# Altium schematic sheet 12V.SchDoc
size A3; SheetNumber: 23; SheetTotal: 29; SPICEModelCacheJKCRVRTA: <root> / <DocumentId>JKCRVRTA</DocumentId> / </root>
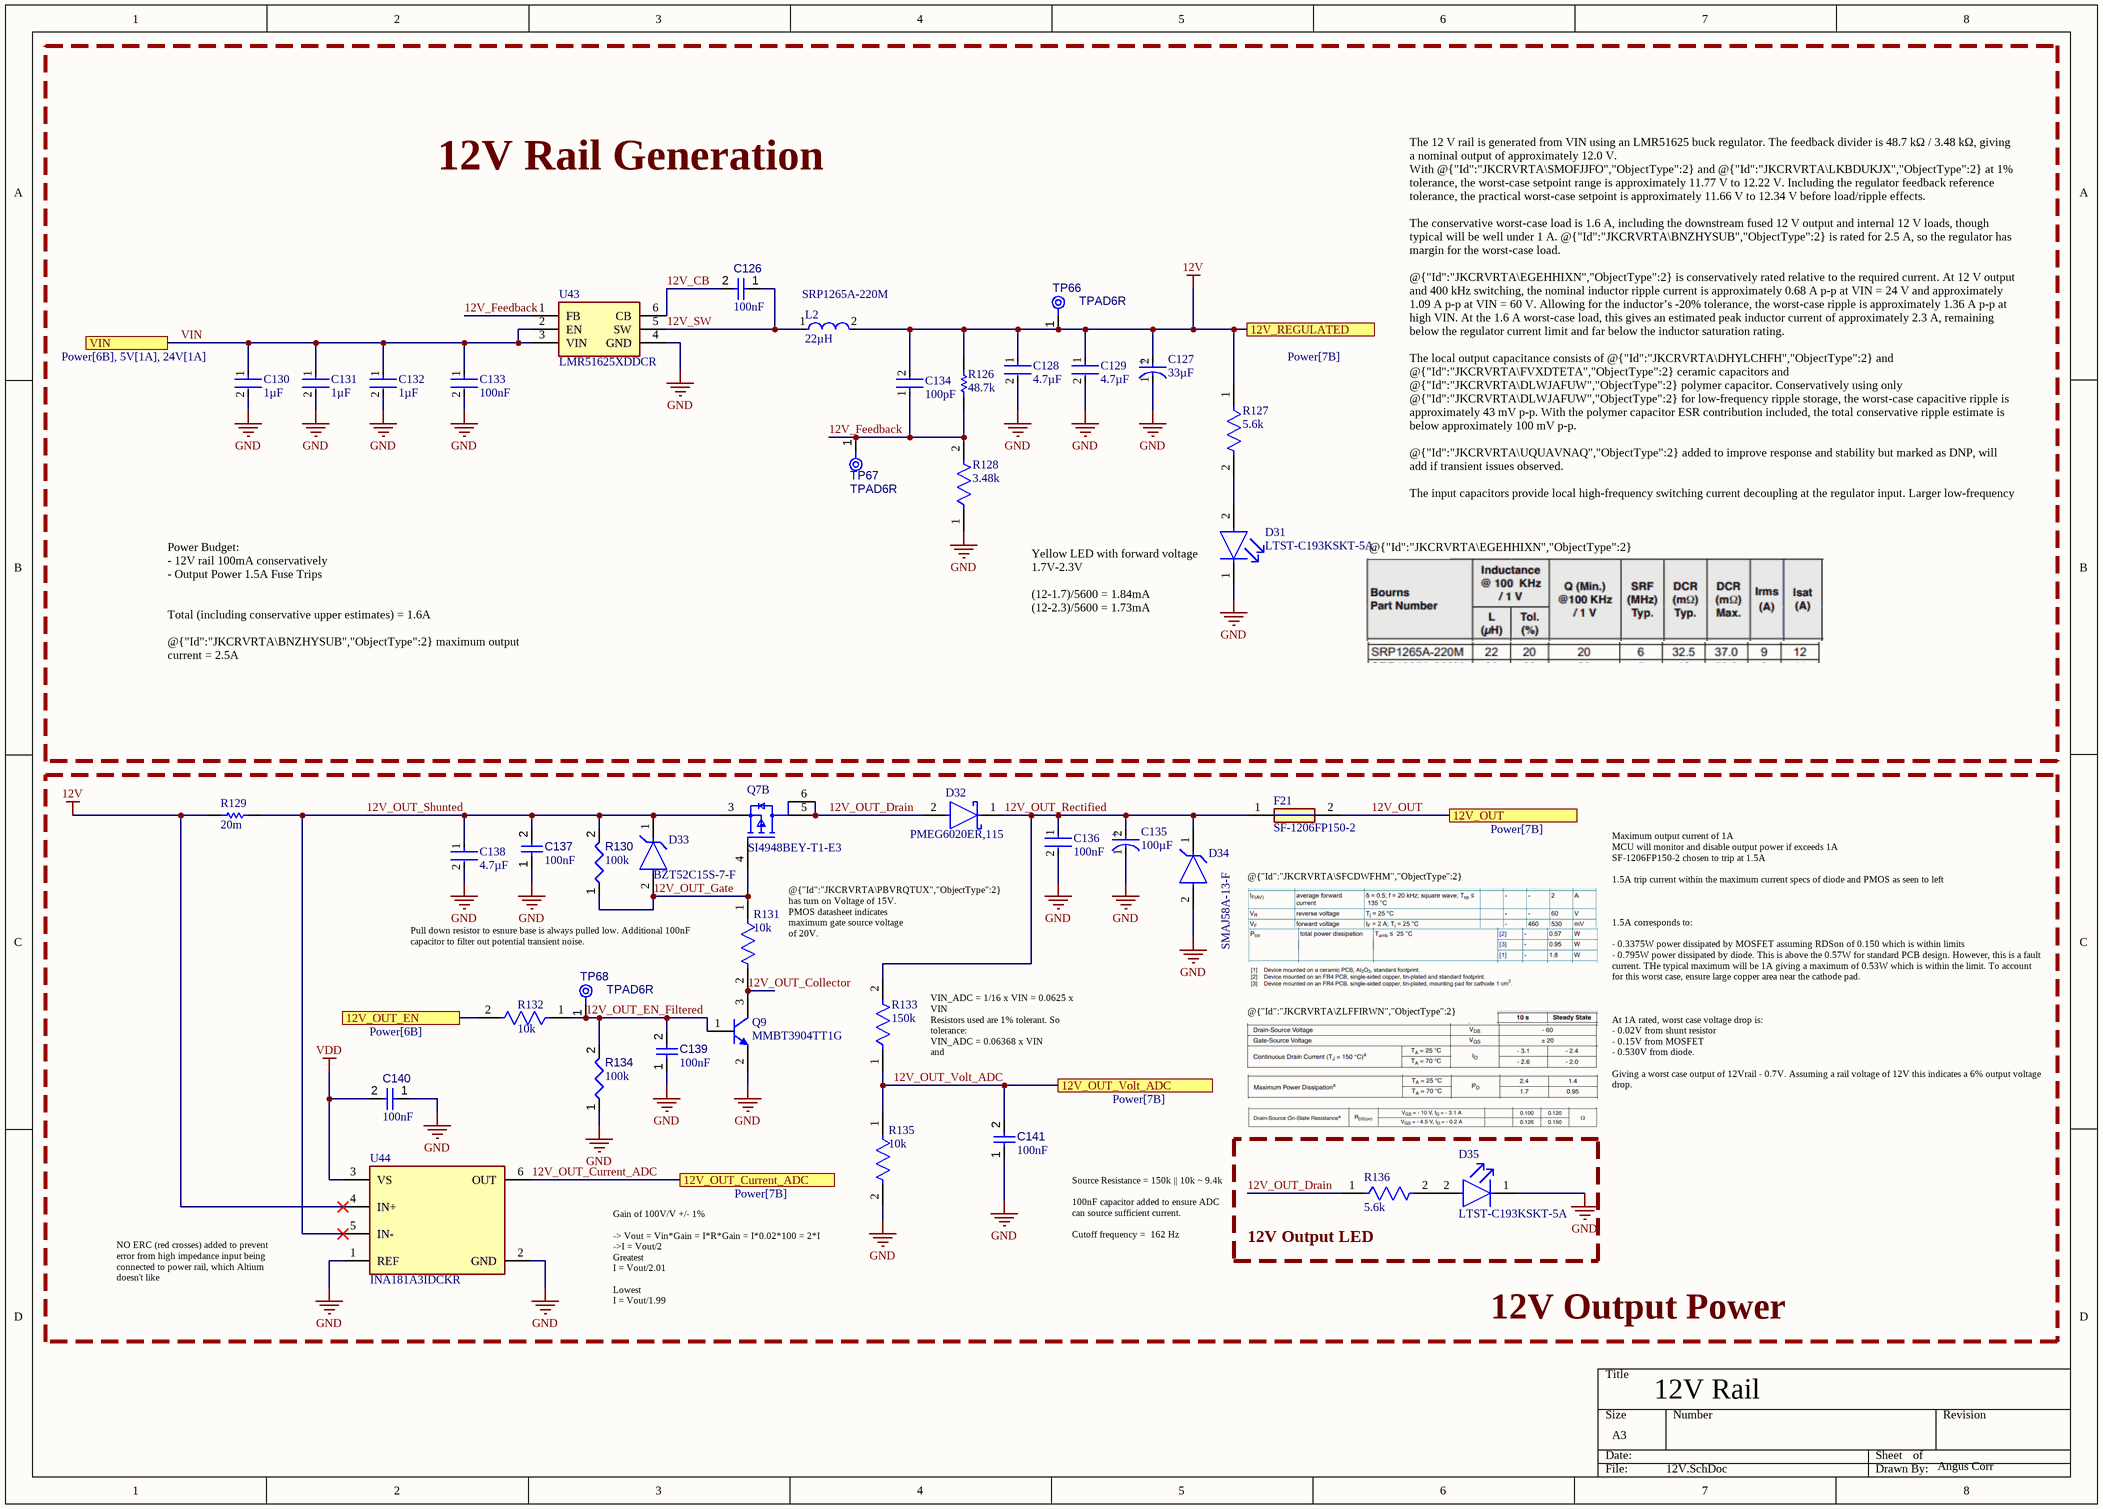
[diagram p0: 12V.SchDoc]

## Parts
C126  value 100nF  [CAPC1608X90X40NL10T20]  (hidden comment: Capacitor 100 nF +/-10% 50 V 0603)
C127  value 33µF  [FP-EEH-D8-MFG]  (hidden comment: EEHZA1H330XP)
C128  value 4.7µF  [FP-GRM21B-0_2-e0_2_0_7-MFG]  (hidden comment: GRM21BZ71H475KE15L)
C129  value 4.7µF  [FP-GRM21B-0_2-e0_2_0_7-MFG]  (hidden comment: GRM21BZ71H475KE15L)
C130  value 1µF  [FP-GRJ21B-0_35-MFG]  (hidden comment: GRJ21BC72A105KE11L)
C131  value 1µF  [FP-GRJ21B-0_35-MFG]  (hidden comment: GRJ21BC72A105KE11L)
C132  value 1µF  [FP-GRJ21B-0_35-MFG]  (hidden comment: GRJ21BC72A105KE11L)
C133  value 100nF  [FP-GRM31C-0_2-e0_3_0_8-IPC_C]  (hidden comment: GRM31C5C2A104JA01L)
C134  value 100pF  [FP-C0603C-CF-IPC_B]  (hidden comment: C0603C101F5HACTU)
C135  value 100µF  [FP-MVYAKE0-MFG]  (hidden comment: EMVY101ARA101MKE0S)
C136  value 100nF  [FP-GRM31C-0_2-e0_3_0_8-IPC_C]  (hidden comment: GRM31C5C2A104JA01L)
C137  value 100nF  [CAPC1608X90X40NL10T20]  (hidden comment: Capacitor 100 nF +/-10% 50 V 0603)
C138  value 4.7µF  [FP-GRM21B-0_2-e0_2_0_7-MFG]  (hidden comment: GRM21BZ71H475KE15L)
C139  value 100nF  [CAPC1608X90X40NL10T20]  (hidden comment: Capacitor 100 nF +/-10% 50 V 0603)
C140  value 100nF  [CAPC1608X90X40NL10T20]  (hidden comment: Capacitor 100 nF +/-10% 50 V 0603)
C141  value 100nF  [CAPC1608X90X40NL10T20]  (hidden comment: Capacitor 100 nF +/-10% 50 V 0603)
D31  LTST-C193KSKT-5A  [FP-LTST-C193KGKT-5A-MFG]
D32  PMEG6020ER,115  [FP-SOD123W-MFG]
D33  BZT52C15S-7-F  [FP-SOD323-IPC_A]
D34  SMAJ58A-13-F  [FP-SMA-MFG]
D35  LTST-C193KSKT-5A  [FP-LTST-C193KGKT-5A-MFG]
F21  SF-1206FP150-2  [FUSC3116X70N]
L2  value 22µH  [FP-SRP1265A-MFG]  (hidden comment: SRP1265A-220M)
Q7  SI4948BEY-T1-E3  [FP-C-06527-IPC_B]  (part B of 2)
Q9  MMBT3904TT1G  [ONSC-SC-75-3-463-01_V]
R126  value 48.7k  [RESC1608X55X25ML10T15]  (hidden comment: RC0603FR-0748K7L)
R127  value 5.6k  [FP-RT0603-IPC_C]  (hidden comment: RT0603FRE075K6L)
R128  value 3.48k  [FP-AC0603-IPC_C]  (hidden comment: AC0603FR-073K48L)
R129  value 20m  [RESC3216X89X51NL25T25]  (hidden comment: WSL1206R0200FEA)
R130  value 100k  [FP-AC0603-IPC_C]  (hidden comment: AC0603FR-07100KL)
R131  value 10k  [FP-RT0603-IPC_C]  (hidden comment: RT0603BRD0710KL)
R132  value 10k  [FP-RT0603-IPC_C]  (hidden comment: RT0603BRD0710KL)
R133  value 150k  [FP-CRGCQ0603-IPC_A]  (hidden comment: CRGCQ0603F150K)
R134  value 100k  [FP-AC0603-IPC_C]  (hidden comment: AC0603FR-07100KL)
R135  value 10k  [FP-RT0603-IPC_C]  (hidden comment: RT0603BRD0710KL)
R136  value 5.6k  [FP-RT0603-IPC_C]  (hidden comment: RT0603FRE075K6L)
TP66  TPAD6R  [TP06R]  (no BOM)
TP67  TPAD6R  [TP06R]  (no BOM)
TP68  TPAD6R  [TP06R]  (no BOM)
U43  LMR51625XDDCR  [SOT95P280X110-6N]
U44  INA181A3IDCKR  [FP-DCK0006A-IPC_A]

## Blocks framed on the sheet
12V Rail Generation: C126-C134 D31 L2 R126-R128 TP66 TP67 U43
12V Output Power: C135-C141 D32-D34 F21 Q7 Q9 R129-R135 TP68 U44
12V Output LED: D35 R136

## Ports
12V_OUT (see Power[7B]), 12V_OUT_Current_ADC (see Power[7B]), 12V_OUT_EN (see Power[6B]), 12V_OUT_Volt_ADC (see Power[7B]), 12V_REGULATED (see Power[7B]), VIN (see Power[6B], 5V[1A], 24V[1A])

## Nets
12V: C127.2(A) C128.1 C129.1 C134.2 L2.2 R126.2 R127.1 R129.1 TP66.1(TP) U44.4(IN+) ; port 12V_REGULATED
GND: C127.1(C) C128.2 C129.2 C130.2 C131.2 C132.2 C133.2 C135.1(C) C136.2 C137.1 C138.2 C139.1 C140.1 C141.1 D31.1(C) D34.2(A) D35.1(C) Q9.2(E) R128.1 R134.1 R135.2 U43.4(GND) U44.1(REF) U44.2(GND)
VDD: C140.2 U44.3(VS)
12V_CB: C126.2 U43.6(CB)
12V_Feedback: C134.1 R126.1 R128.2 TP67.1(TP) U43.1(FB)
12V_OUT: F21.2 ; port 12V_OUT
12V_OUT_Collector: Q9.3(C) R131.2
12V_OUT_Current_ADC: U44.6(OUT) ; port 12V_OUT_Current_ADC
12V_OUT_Drain: D32.2(A) Q7.5(D2) Q7.6(D2) R136.1
12V_OUT_EN: R132.2 ; port 12V_OUT_EN
12V_OUT_EN_Filtered: C139.2 Q9.1(B) R132.1 R134.2 TP68.1(TP)
12V_OUT_Gate: D33.2(A) Q7.4(G2) R130.1 R131.1
12V_OUT_Rectified: C135.2(A) C136.1 D32.1(C) D34.1(C) F21.1 R133.2
12V_OUT_Shunted: C137.2 C138.1 D33.1(C) Q7.3(S2) R129.2 R130.2 U44.5(IN-)
12V_OUT_Volt_ADC: C141.2 R133.1 R135.1 ; port 12V_OUT_Volt_ADC
12V_SW: C126.1 L2.1 U43.5(SW)
VIN: C130.1 C131.1 C132.1 C133.1 U43.2(EN) U43.3(VIN) ; port VIN
NetD31_2: D31.2(A) R127.2
NetD35_2: D35.2(A) R136.2

## Notes on the sheet
- (near L2) SRP1265A-220M
- The 12 V rail is generated from VIN using an LMR51625 buck regulator. The feedback divider is 48.7 kΩ / 3.48 kΩ, giving a nominal output of approximately 12.0 V.
  With @{"Id":"JKCRVRTA\SMOFJJFO","ObjectType":2} and @{"Id":"JKCRVRTA\LKBDUKJX","ObjectType":2} at 1% tolerance, the worst-case setpoint range is approximately 11.77 V to 12.22 V. Including the regulator feedback reference tolerance, the practical worst-case setpoint is approximately 11.66 V to 12.34 V before load/ripple effects.
  The conservative worst-case load is 1.6 A, including the downstream fused 12 V output and internal 12 V loads, though typical will be well under 1 A. @{"Id":"JKCRVRTA\BNZHYSUB","ObjectType":2} is rated for 2.5 A, so the regulator has margin for the worst-case load.
  @{"Id":"JKCRVRTA\EGEHHIXN","ObjectType":2} is conservatively rated relative to the required current. At 12 V output and 400 kHz switching, the nominal inductor ripple current is approximately 0.68 A p-p at VIN = 24 V and approximately 1.09 A p-p at VIN = 60 V. Allowing for the inductor’s -20% tolerance, the worst-case ripple is approximately 1.36 A p-p at high VIN. At the 1.6 A worst-case load, this gives an estimated peak inductor current of approximately 2.3 A, remaining below the regulator current limit and far below the inductor saturation rating.
  The local output capacitance consists of @{"Id":"JKCRVRTA\DHYLCHFH","ObjectType":2} and @{"Id":"JKCRVRTA\FVXDTETA","ObjectType":2} ceramic capacitors and @{"Id":"JKCRVRTA\DLWJAFUW","ObjectType":2} polymer capacitor. Conservatively using only @{"Id":"JKCRVRTA\DLWJAFUW","ObjectType":2} for low-frequency ripple storage, the worst-case capacitive ripple is approximately 43 mV p-p. With the polymer capacitor ESR contribution included, the total conservative ripple estimate is below approximately 100 mV p-p.
  @{"Id":"JKCRVRTA\UQUAVNAQ","ObjectType":2} added to improve response and stability but marked as DNP, will add if transient issues observed.
  The input capacitors provide local high-frequency switching current decoupling at the regulator input. Larger low-frequency energy storage is provided by the upstream 100 µF bulk capacitance.
  VIN should remain comfortably above 12 V under load. In normal operation from the 24 V/VIN rail there is substantial duty-cycle margin, unlike the 24 V regulator which operates closer to dropout.
- @{"Id":"JKCRVRTA\EGEHHIXN","ObjectType":2} stats
- (near D31) Yellow LED with forward voltage 1.7V-2.3V
  (12-1.7)/5600 = 1.84mA
  (12-2.3)/5600 = 1.73mA
- Power Budget:
  - 12V rail 100mA conservatively
  - Output Power 1.5A Fuse Trips
  Total (including conservative upper estimates) = 1.6A
  @{"Id":"JKCRVRTA\BNZHYSUB","ObjectType":2} maximum output current = 2.5A
- @{"Id":"JKCRVRTA\SFCDWFHM","ObjectType":2} specs
- Pull down resistor to esnure base is always pulled low. Additional 100nF capacitor to filter out potential transient noise.
- @{"Id":"JKCRVRTA\PBVRQTUX","ObjectType":2} has turn on Voltage of 15V. PMOS datasheet indicates maximum gate source voltage of 20V.
- VIN_ADC = 1/16 x VIN = 0.0625 x VIN
  Resistors used are 1% tolerant. So tolerance:
  VIN_ADC = 0.06368 x VIN
  and
  VIN_ADC = 0.06238 x VIN
- @{"Id":"JKCRVRTA\ZLFFIRWN","ObjectType":2} specs
- Source Resistance = 150k || 10k ~ 9.4k
  100nF capacitor added to ensure ADC can source sufficient current.
  Cutoff frequency =  162 Hz
- Maximum output current of 1A
  MCU will monitor and disable output power if exceeds 1A
  SF-1206FP150-2 chosen to trip at 1.5A
  1.5A trip current within the maximum current specs of diode and PMOS as seen to left
  1.5A corresponds to:
  - 0.3375W power dissipated by MOSFET assuming RDSon of 0.150 which is within limits
  - 0.795W power dissipated by diode. This is above the 0.57W for standard PCB design. However, this is a fault current. THe typical maximum will be 1A giving a maximum of 0.53W which is within the limit. To account for this worst case, ensure large copper area near the cathode pad.
  At 1A rated, worst case voltage drop is:
  - 0.02V from shunt resistor
  - 0.15V from MOSFET
  - 0.530V from diode.
  Giving a worst case output of 12Vrail - 0.7V. Assuming a rail voltage of 12V this indicates a 6% output voltage drop.
- NO ERC (red crosses) added to prevent error from high impedance input being connected to power rail, which Altium doesn't like
- (near R135) Gain of 100V/V +/- 1%
  -> Vout = Vin*Gain = I*R*Gain = I*0.02*100 = 2*I
  ->I = Vout/2
  Greatest
  I = Vout/2.01
  Lowest
  I = Vout/1.99
- 12V Rail
- Angus Corr
- (in symbol CMP-001-00104-1) +
- (in symbol CMP-001-00147-1) +

## Library data of the parts
C126 C137 C139-C141 = CMP-001-00017-6: Chip Capacitor, 100 nF, +/- 10%, 50 V, 0603 (1608 Metric); Voltage Rating: 50V; Capacitor Type: Ceramic; Tolerance: 10%; Mounting Technology: SM; Max Operating Temperature: 125°C; RoHS Compliant: True; Pins: 2; Case/Package: 0603; Min Operating Temperature: -55°C
C127 = CMP-001-00147-1: Cap Aluminum 33uF 50V 20% (6.3 X 7.7mm) SMD 0.04 Ohm 1600mA 5000 hr 105°C Embossed T/R; Ripple Current (AC): 1.6A; Max Operating Temperature: 105°C; Voltage Rating: 50V; Mounting Technology: Surface Mount; Pins: 8; Ripple Current: 1.6A; Tolerance: 20%; Min Operating Temperature: -55°C; Case/Package: Radial
C128 C129 C138 = CMP-001-00149-1: 50V 4.7uF X7R ±10% 0805 Multilayer Ceramic Capacitors MLCC - SMD/SMT ROHS; Manufacturer Lifecycle Status: IN PRODUCTION; Case/Package: 0805; Tolerance: 10%; Voltage Rating: 50V; Min Operating Temperature: -55°C; Mounting Technology: Surface Mount; Max Operating Temperature: 125°C; Country of Origin: Japan, Mainland China, Philippines, Singapore, Thailand; Dielectric Material: Ceramic; Export Control Classification Number (ECCN) Code: EAR99; Harmonized Tariff Schedule (HTS) Code: 8532.24.00.20; Height: 1.25mm; Introduction Date: 2017-02-22; Length: 2mm; Lifecycle Status: Production; Material: Ceramic; Number of Terminals: 2; REACH SVHC: Yes; RoHS: Compliant; Thickness: 1.25mm; Voltage Rating (DC): 50V; Width: 1.25mm
C130-C132 = CMP-001-00143-2: 100V 1uF X7S ±10% 0805 Multilayer Ceramic Capacitors MLCC - SMD/SMT ROHS; Manufacturer Lifecycle Status: IN PRODUCTION; Mounting Technology: Surface Mount; Voltage Rating: 100V; Max Operating Temperature: 125°C; Min Operating Temperature: -55°C; Tolerance: 10%; Case/Package: 0805; Case Code (Imperial): 0805; Case Code (Metric): 2012; Dielectric Material: Ceramic; Dielectric: X7S; Export Control Classification Number (ECCN) Code: EAR99; Features: Soft Termination; Harmonized Tariff Schedule (HTS) Code: 8532.24.00.20; Height: 1.25mm; Introduction Date: 2015-11-10; Length: 2mm; Lifecycle Status: Production; Material: Ceramic; Number of Terminals: 2; Packaging: Cut Tape; REACH SVHC: Yes; RoHS: Compliant; Schedule B: 8532240020, 8532240020; Thickness: 1.25mm; Voltage Rating (DC): 100V; Width: 1.25mm
C133 C136 = CMP-001-00103-1: 100V 100nF C0G ±5% 1206 Multilayer Ceramic Capacitors MLCC - SMD/SMT ROHS; Min Operating Temperature: -55°C; Mounting Technology: Surface Mount; Case/Package: 1206; Max Operating Temperature: 125°C; Tolerance: 5%; Voltage Rating: 100V
C134 = CMP-001-00115-1: Multilayer Ceramic Capacitors MLCC - SMD/SMT 50V 100pF X8R 0603 1%; Temperature Coefficient: 30ppm/°C; Lead Free: Lead Free; Width: 800µm; Schedule B: 8532240020, 8532240020; Introduction Date: 2017-10-02; Harmonized Tariff Schedule (HTS) Code: 8532.24.00.20; Voltage Rating (DC): 50V; Lifecycle Status: Production; Number of Terminals: 2; Height: 800µm; REACH SVHC: Yes; Dielectric Material: Ceramic; Country of Origin: Mexico; Voltage Rating: 50V; Mounting Technology: Surface Mount; Length: 1.6mm; China RoHS: Compliant; RoHS: Compliant; Case/Package: 0603; Max Operating Temperature: 150°C; Export Control Classification Number (ECCN) Code: EAR99; Dielectric: X8R; Material: Ceramic; Min Operating Temperature: -55°C
C135 = CMP-001-00104-1: Cap Aluminum 100uF 100V 20% (12.5 X 13.5mm) SMD 450mA 5000h 105°C T/R; Mounting Technology: Surface Mount; Ripple Current: 450mA; Tolerance: 20%; Case/Package: SMD/SMT; Pins: 2; Max Operating Temperature: 105°C; Min Operating Temperature: -40°C; Voltage Rating: 100V; Ripple Current (AC): 450mA
D31 D35 = CMP-007-00044-1: LED yellow 0603 wavelength 587~594.5nm light intensity 7.1~45mcd Front Mounting; Shape: Rectangular; Power Dissipation: 50mW; Peak Wavelength: 591nm; Number of Circuits: 1; Lens Style: Colorless, Diffused, Rectangular; Test Current: 5mA; Forward Voltage: 2.3V; Lens Transparency: Clear; Lens Color: Clear, Colorless; Viewing Angle: 130°; Forward Current: 30mA; Reverse Voltage: 5V; Luminous Intensity: 26.05mcd; Schedule B: 8541402000, 8541402000; Introduction Date: 2007-04-09; Min Operating Temperature: -55°C; RoHS: Compliant; Terminal Pitch: 1.5mm; Case/Package: 0603; Width: 800µm; Dominant Wavelength: 594.5nm; Pins: 2; Case Code (Imperial): 0603; Height: 350µm; Length: 1.6mm; Color: Yellow; Lead Free: Lead Free; Max Operating Temperature: 85°C; Wavelength: 594.5nm; Harmonized Tariff Schedule (HTS) Code: 8541.40.20.00; China RoHS: Compliant; Illumination Color: Yellow; Number of Terminals: 2; Radiation Hardening: No; Case Code (Metric): 1608; Number of LEDs: 1; Depth: 800µm; Lifecycle Status: Production; REACH SVHC: Yes; Mounting Technology: Surface Mount; Number of Elements: 1
D32 = CMP-004-00064-1: PMEG6020 Series 60 V 2 A SMT Llow VF MEGA Schottky Barrier Rectifier - SOD-123W; Forward Current: 2A; Forward Voltage: 530mV; Min Operating Temperature: -55°C; Max Operating Temperature: 150°C; Pins: 2
D33 = CMP-004-00045-1: BZT52C15S Series 200 mW 15 V 10 mA Surface Mount Zener Diode - SOD-323; Forward Voltage: 900mV; Forward Current: 10mA; Pins: 2; Max Operating Temperature: 150°C; Mounting Technology: Surface Mount; Min Operating Temperature: -65°C
D34 = CMP-004-00082-1: SMAJ Series 58 V 400 W SMT Uni-Directional TVS Diode - DO-214AC; Forward Voltage: 3.5V; Max Surge Current: 40A; Case/Package: SMA; Max Operating Temperature: 150°C; Min Operating Temperature: -55°C; Mounting Technology: Surface Mount; Pins: 2
F21 = CMP-005-00025-1: Surface Mount Fuses 1.5A Fast Acting 1206 Singlfuse; Manufacturer_Name: Bourns; Mouser Part Number: 652-SF-1206FP150-2; Mouser Price/Stock: https://www.mouser.co.uk/ProductDetail/Bourns/SF-1206FP150-2?qs=YCa%2FAAYMW02QT85STQYHfQ%3D%3D; Manufacturer_Part_Number: SF-1206FP150-2; Datasheet Link: https://www.arrow.com/en/products/sf-1206fp150-2/bourns; Source: MAX17643ATC+.SchLib; Arrow Part Number: SF-1206FP150-2; Design Item ID: SF-1206FP150-2; Height: 0.7mm; Arrow Price/Stock: https://www.arrow.com/en/products/sf-1206fp150-2/bourns?utm_currency=USD&region=nac
L2 = CMP-006-00026-1: Inductor Power Shielded Wirewound 22uH 20% 100KHz 20Q-Factor Carbonyl Powder 9A 0.037Ohm DCR Automotive T/R; Self Resonant Frequency: 6MHz; Min Operating Temperature: -55°C; Tolerance: 20%; Max Current Rating: 9A; Case/Package: Nonstandard; Max Operating Temperature: 150°C; Mounting Technology: Surface Mount; Current Rating: 9A
Q7 = CMP-013-00038-1: Dual P-Channel 60 V 0.12 Ohms Surface Mount Power Mosfet - SOIC-8; Nominal Vgs: -3V; Max Operating Temperature: 175°C; Mounting Technology: Surface Mount; Min Operating Temperature: -55°C; Case/Package: SO; Pins: 8
Q9 = CMP-013-00039-1: on Semi MMBT3904TT1G NPN Bipolar Transistor, 0.2 A, 40 V, 3-PIN SOT-416; Frequency: 300MHz; Min Operating Temperature: -55°C; Max Operating Temperature: 150°C; Case/Package: SOT-416; Pins: 3
R126 = CMP-009-00329-1: Res Thick Film 0603 48.7K Ohm 1% 0.1W(1/10W) ±100ppm/C Pad SMD T/R; Working Voltage: 75V; Voltage Rating (DC): 50V; Temperature Coefficient: 100ppm/°C; Power Rating: 100mW; Length: 1.6mm; Lead Free: Lead Free; Composition: Thick Film; Termination: SMD/SMT; RoHS: Compliant; China RoHS: Non-Compliant; Depth: 800µm; Lifecycle Status: Production; Military Standard: Not; Min Operating Temperature: -55°C; Case Code (Imperial): 0603; Features: Moisture Resistant; Number of Terminals: 2; REACH SVHC: Yes; Mounting Technology: Surface Mount; Width: 800µm; Voltage Rating: 75V; Max Operating Temperature: 155°C; Max Power Dissipation: 100mW; Height: 450µm; Tolerance: 1%; Number of Terminations: 2; Schedule B: 8533210045, 8533210045; Case/Package: 0603
R127 R136 = CMP-009-00325-1: Fixed Resistor, Thin Film, 0.1W, 5600ohm, 75V, 1% +/-Tol, 50ppm/Cel, Surface Mount, 0603; Power Rating: 100mW; Temperature Coefficient: 50ppm/°C; Pins: 2; Tolerance: 1%; Lifecycle Status: Production; Composition: Thin Film; REACH SVHC: Yes; Working Voltage: 75V; Voltage Rating (DC): 75V; Case/Package: 0603; Voltage Rating: 75V; Mounting Technology: Surface Mount; Length: 1.6mm; Max Operating Temperature: 155°C; Number of Terminals: 2; Schedule B: 8533210045, 8533210045; Width: 800µm; China RoHS: Non-Compliant; Height: 450µm; Min Operating Temperature: -55°C; RoHS: Compliant; Case Code (Imperial): 0603; Depth: 800µm; Lead Free: Lead Free; Max Power Dissipation: 100mW; Military Standard: Not; Number of Terminations: 2; Termination: SMD/SMT
R128 = CMP-009-00282-1: Res Thick Film 0603 3.48K Ohm 1% 0.1W(1/10W) ±100ppm/C Pad SMD T/R Automotive AEC-Q200; Voltage Rating: 75V; Max Operating Temperature: 155°C; Mounting Technology: Surface Mount; Min Operating Temperature: -55°C; Tolerance: 1%; Case/Package: 0603
R129 = CMP-009-00308-1: Res Metal Strip 1206 0.02 Ohm 1% 1/4W ±75ppm/°C Molded SMD SMD Embossed Plastic T/R; Voltage Rating: 70mV; Pins: 2; Min Operating Temperature: -65°C; Tolerance: 1%; Mounting Technology: Surface Mount; Max Operating Temperature: 170°C; Case/Package: 1206
R130 R134 = CMP-009-00345-3: Res Thick Film 0603 100K Ohm 1% 0.1W(1/10W) ±100ppm/C Pad SMD T/R Automotive; Voltage Rating: 75V; Max Power Dissipation: 100mW; Temperature Coefficient: 100ppm/°C; Max Operating Temperature: 155°C; Tolerance: 1%; Case/Package: 0603; Mounting Technology: Surface Mount; Min Operating Temperature: -55°C; Case Code (Imperial): 0603; Case Code (Metric): 1608; China RoHS: Non-Compliant; Composition: Thick Film; Country of Origin: Mainland China, Taiwan; Depth: 800µm; Export Control Classification Number (ECCN) Code: EAR99; Features: Anti-Sulfur, Automotive AEC-Q200, Moisture Resistant; Harmonized Tariff Schedule (HTS) Code: 8533.21.00.30; Height: 450µm; Introduction Date: 2012-04-10; Lead Free: Lead Free; Length: 1.6mm; Lifecycle Status: Production; Military Standard: Not; Number of Terminals: 2; Number of Terminations: 2; Packaging: Tape & Reel; Power Rating: 100mW; Ratings: AEC-Q200; REACH SVHC: Yes; RoHS: Compliant; Schedule B: 8533210045, 8533210045; Termination: SMD/SMT; Width: 800µm; Working Voltage: 75V
R131 R132 R135 = CMP-009-00322-1: Res Thin Film 0603 10K Ohm 0.1% 1/10W |25ppm/|C SMD Paper T/R; Voltage Rating: 75V; Max Power Dissipation: 100mW; Temperature Coefficient: 25ppm/°C; Min Operating Temperature: -55°C; Case/Package: 0603; Mounting Technology: Surface Mount; Max Operating Temperature: 155°C; Tolerance: 0.1%; Case Code (Imperial): 0603; China RoHS: Non-Compliant; Composition: Thin Film; Country of Origin: Mainland China, Taiwan; Depth: 800µm; Export Control Classification Number (ECCN) Code: EAR99; Features: Moisture Resistant; Harmonized Tariff Schedule (HTS) Code: 8533.21.00.30; Height: 450µm; Introduction Date: 2008-06-09; Lead Free: Lead Free; Length: 1.6mm; Lifecycle Status: Production; Military Standard: Not; Number of Terminals: 2; Number of Terminations: 2; Power Rating: 100mW; REACH SVHC: Yes; RoHS: Compliant; Schedule B: 8533210045, 8533210045; Termination: SMD/SMT; Voltage Rating (DC): 75V; Weight: 2.012816mg; Width: 800µm; Working Voltage: 75V
R133 = CMP-009-00207-1: Res Thick Film 0603 150K Ohm 1% 0.1W(1/10W) ±100ppm/C Pad SMD Automotive T/R; Voltage Rating: 75V; Mounting Technology: Surface Mount; Case/Package: 0603; Min Operating Temperature: -55°C; Max Operating Temperature: 155°C; Tolerance: 1%
TP66-TP68 = CMP-00028-00002-2: 0.6mm round; Pins: 1
U43 = CMP-031-00022-1: Switching Voltage Regulators SIMPLE SWITCHER synchronous buck converter with 4.3V-to-60V; Manufacturer_Name: Texas Instruments; Source: MAX17643ATC+.SchLib; Mouser Part Number: 595-LMR51625XDDCR; Manufacturer_Part_Number: LMR51625XDDCR; Arrow Price/Stock: https://www.arrow.com/en/products/lmr51625xddcr/texas-instruments.html?utm_currency=USD&region=nac; Mouser Price/Stock: https://www.mouser.co.uk/ProductDetail/Texas-Instruments/LMR51625XDDCR?qs=efUn273yAheKjJQ13bmSQQ%3D%3D; Height: 1.1mm; Datasheet Link: https://www.ti.com/lit/ds/symlink/lmr51625.pdf?ts=1740555768028; Arrow Part Number: LMR51625XDDCR; Design Item ID: LMR51625XDDCR
U44 = CMP-014-00006-1: 26-V bi-directional 350-kHz current-sense amplifier 6-SC70 -40 to 125; Max Supply Voltage: 5.5V; Min Supply Voltage: 2.7V; Min Operating Temperature: -40°C; Pins: 6; Max Operating Temperature: 125°C